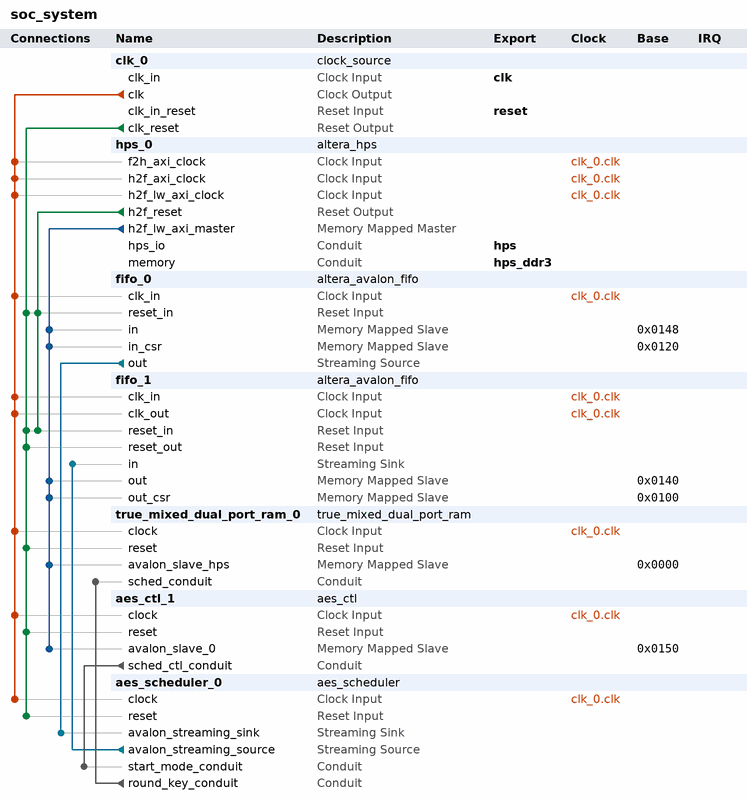
[diagram p0: system contents]
# Platform Designer (Qsys) system soc_system, Cyclone V 5CSEMA5F31C6
# Parameters at their usual value, and those the tool derives, are not listed.
package require -exact qsys 21.1
create_system soc_system
set_project_property DEVICE_FAMILY {Cyclone V}
set_project_property DEVICE 5CSEMA5F31C6

add_instance clk_0 clock_source 21.1
set_instance_parameter_value clk_0 clockFrequency 50000000

add_instance hps_0 altera_hps 21.1
set_instance_parameter_value hps_0 EMAC1_Mode RGMII
set_instance_parameter_value hps_0 EMAC1_PinMuxing {HPS I/O Set 0}
set_instance_parameter_value hps_0 F2SCLK_COLDRST_Enable false
set_instance_parameter_value hps_0 F2SCLK_DBGRST_Enable false
set_instance_parameter_value hps_0 F2SCLK_WARMRST_Enable false
set_instance_parameter_value hps_0 F2SINTERRUPT_Enable false
set_instance_parameter_value hps_0 F2S_Width 2
set_instance_parameter_value hps_0 FPGA_PERIPHERAL_OUTPUT_CLOCK_FREQ_EMAC0_GTX_CLK 125
set_instance_parameter_value hps_0 FPGA_PERIPHERAL_OUTPUT_CLOCK_FREQ_EMAC0_MD_CLK 2.5
set_instance_parameter_value hps_0 FPGA_PERIPHERAL_OUTPUT_CLOCK_FREQ_EMAC1_GTX_CLK 125
set_instance_parameter_value hps_0 FPGA_PERIPHERAL_OUTPUT_CLOCK_FREQ_EMAC1_MD_CLK 2.5
set_instance_parameter_value hps_0 HPS_PROTOCOL DDR3
set_instance_parameter_value hps_0 I2C0_Mode I2C
set_instance_parameter_value hps_0 I2C0_PinMuxing {HPS I/O Set 0}
set_instance_parameter_value hps_0 I2C1_Mode I2C
set_instance_parameter_value hps_0 I2C1_PinMuxing {HPS I/O Set 0}
set_instance_parameter_value hps_0 LWH2F_Enable true
set_instance_parameter_value hps_0 MEM_BANKADDR_WIDTH 3
set_instance_parameter_value hps_0 MEM_CLK_FREQ 400.0
set_instance_parameter_value hps_0 MEM_COL_ADDR_WIDTH 10
set_instance_parameter_value hps_0 MEM_DQ_WIDTH 32
set_instance_parameter_value hps_0 MEM_DRV_STR RZQ/7
set_instance_parameter_value hps_0 MEM_ROW_ADDR_WIDTH 15
set_instance_parameter_value hps_0 MEM_RTT_NOM RZQ/4
set_instance_parameter_value hps_0 MEM_RTT_WR RZQ/4
set_instance_parameter_value hps_0 MEM_TCL 11
set_instance_parameter_value hps_0 MEM_TFAW_NS 30.0
set_instance_parameter_value hps_0 MEM_TRAS_NS 35.0
set_instance_parameter_value hps_0 MEM_TRCD_NS 13.75
set_instance_parameter_value hps_0 MEM_TRFC_NS 260.0
set_instance_parameter_value hps_0 MEM_TRP_NS 13.75
set_instance_parameter_value hps_0 MEM_TRRD_NS 7.7
set_instance_parameter_value hps_0 MEM_VENDOR JEDEC
set_instance_parameter_value hps_0 MEM_WTCL 8
set_instance_parameter_value hps_0 QSPI_Mode N/A
set_instance_parameter_value hps_0 QSPI_PinMuxing Unused
set_instance_parameter_value hps_0 REF_CLK_FREQ 25.0
set_instance_parameter_value hps_0 S2FCLK_USER1CLK_Enable true
set_instance_parameter_value hps_0 S2FCLK_USER2CLK 5
set_instance_parameter_value hps_0 S2F_Width 2
set_instance_parameter_value hps_0 SDIO_Mode {4-bit Data}
set_instance_parameter_value hps_0 SDIO_PinMuxing {HPS I/O Set 0}
set_instance_parameter_value hps_0 SPIM1_Mode {Single Slave Select}
set_instance_parameter_value hps_0 SPIM1_PinMuxing {HPS I/O Set 0}
set_instance_parameter_value hps_0 STM_Enable false
set_instance_parameter_value hps_0 TIMING_BOARD_AC_SKEW 0.03
set_instance_parameter_value hps_0 TIMING_BOARD_AC_TO_CK_SKEW 0.0
set_instance_parameter_value hps_0 TIMING_BOARD_DQ_TO_DQS_SKEW 0.0
set_instance_parameter_value hps_0 TIMING_BOARD_MAX_CK_DELAY 0.03
set_instance_parameter_value hps_0 TIMING_BOARD_MAX_DQS_DELAY 0.02
set_instance_parameter_value hps_0 TIMING_BOARD_SKEW_BETWEEN_DQS 0.08
set_instance_parameter_value hps_0 TIMING_BOARD_SKEW_CKDQS_DIMM_MAX 0.16
set_instance_parameter_value hps_0 TIMING_BOARD_SKEW_CKDQS_DIMM_MIN 0.09
set_instance_parameter_value hps_0 TIMING_BOARD_SKEW_WITHIN_DQS 0.01
set_instance_parameter_value hps_0 TIMING_TDH 65
set_instance_parameter_value hps_0 TIMING_TDQSCK 255
set_instance_parameter_value hps_0 TIMING_TDQSQ 125
set_instance_parameter_value hps_0 TIMING_TDS 30
set_instance_parameter_value hps_0 TIMING_TIH 140
set_instance_parameter_value hps_0 TIMING_TIS 180
set_instance_parameter_value hps_0 TIMING_TQSH 0.4
set_instance_parameter_value hps_0 UART0_Mode {No Flow Control}
set_instance_parameter_value hps_0 UART0_PinMuxing {HPS I/O Set 0}
set_instance_parameter_value hps_0 USB1_Mode SDR
set_instance_parameter_value hps_0 USB1_PinMuxing {HPS I/O Set 0}
set_instance_parameter_value hps_0 desired_cfg_clk_mhz 97.368421
set_instance_parameter_value hps_0 desired_qspi_clk_mhz 400.0

add_instance fifo_0 altera_avalon_fifo 21.1
set_instance_parameter_value fifo_0 bitsPerSymbol 32
set_instance_parameter_value fifo_0 channelWidth 8
set_instance_parameter_value fifo_0 errorWidth 8
set_instance_parameter_value fifo_0 fifoDepth 2048
set_instance_parameter_value fifo_0 fifoInputInterfaceOptions AVALONMM_WRITE
set_instance_parameter_value fifo_0 fifoOutputInterfaceOptions AVALONST_SOURCE
set_instance_parameter_value fifo_0 singleClockMode true
set_instance_parameter_value fifo_0 symbolsPerBeat 1
set_instance_parameter_value fifo_0 useIRQ false
set_instance_parameter_value fifo_0 usePacket false
set_instance_parameter_value fifo_0 useReadControl false

add_instance fifo_1 altera_avalon_fifo 21.1
set_instance_parameter_value fifo_1 bitsPerSymbol 32
set_instance_parameter_value fifo_1 channelWidth 8
set_instance_parameter_value fifo_1 errorWidth 8
set_instance_parameter_value fifo_1 fifoDepth 2048
set_instance_parameter_value fifo_1 fifoInputInterfaceOptions AVALONST_SINK
set_instance_parameter_value fifo_1 fifoOutputInterfaceOptions AVALONMM_READ
set_instance_parameter_value fifo_1 singleClockMode false
set_instance_parameter_value fifo_1 symbolsPerBeat 1
set_instance_parameter_value fifo_1 useIRQ false
set_instance_parameter_value fifo_1 usePacket false
set_instance_parameter_value fifo_1 useReadControl true
set_instance_parameter_value fifo_1 useWriteControl false

add_instance true_mixed_dual_port_ram_0 true_mixed_dual_port_ram 1.0
set_instance_parameter_value true_mixed_dual_port_ram_0 ADDRESS_WIDTH1 6
set_instance_parameter_value true_mixed_dual_port_ram_0 ADDRESS_WIDTH2 4
set_instance_parameter_value true_mixed_dual_port_ram_0 DATA_WIDTH1 32

add_instance aes_ctl_1 aes_ctl 1.0

add_instance aes_scheduler_0 aes_scheduler 1.0
set_instance_parameter_value aes_scheduler_0 N_CORES 10

# connections
add_connection clk_0.clk aes_ctl_1.clock clock
add_connection clk_0.clk aes_scheduler_0.clock clock
add_connection clk_0.clk fifo_0.clk_in clock
add_connection clk_0.clk fifo_1.clk_in clock
add_connection clk_0.clk fifo_1.clk_out clock
add_connection clk_0.clk hps_0.f2h_axi_clock clock
add_connection clk_0.clk hps_0.h2f_axi_clock clock
add_connection clk_0.clk hps_0.h2f_lw_axi_clock clock
add_connection clk_0.clk true_mixed_dual_port_ram_0.clock clock
add_connection clk_0.clk_reset aes_ctl_1.reset reset
add_connection clk_0.clk_reset aes_scheduler_0.reset reset
add_connection clk_0.clk_reset fifo_0.reset_in reset
add_connection clk_0.clk_reset fifo_1.reset_in reset
add_connection clk_0.clk_reset fifo_1.reset_out reset
add_connection clk_0.clk_reset true_mixed_dual_port_ram_0.reset reset
add_connection hps_0.h2f_reset fifo_0.reset_in reset
add_connection hps_0.h2f_reset fifo_1.reset_in reset
add_connection hps_0.h2f_lw_axi_master aes_ctl_1.avalon_slave_0 avalon
set_connection_parameter_value hps_0.h2f_lw_axi_master/aes_ctl_1.avalon_slave_0 baseAddress 0x0150
add_connection hps_0.h2f_lw_axi_master fifo_0.in avalon
set_connection_parameter_value hps_0.h2f_lw_axi_master/fifo_0.in baseAddress 0x0148
add_connection hps_0.h2f_lw_axi_master fifo_0.in_csr avalon
set_connection_parameter_value hps_0.h2f_lw_axi_master/fifo_0.in_csr baseAddress 0x0120
add_connection hps_0.h2f_lw_axi_master fifo_1.out avalon
set_connection_parameter_value hps_0.h2f_lw_axi_master/fifo_1.out baseAddress 0x0140
add_connection hps_0.h2f_lw_axi_master fifo_1.out_csr avalon
set_connection_parameter_value hps_0.h2f_lw_axi_master/fifo_1.out_csr baseAddress 0x0100
add_connection hps_0.h2f_lw_axi_master true_mixed_dual_port_ram_0.avalon_slave_hps avalon
set_connection_parameter_value hps_0.h2f_lw_axi_master/true_mixed_dual_port_ram_0.avalon_slave_hps baseAddress 0x0000
add_connection aes_scheduler_0.avalon_streaming_source fifo_1.in avalon_streaming
add_connection fifo_0.out aes_scheduler_0.avalon_streaming_sink avalon_streaming
add_connection aes_ctl_1.sched_ctl_conduit aes_scheduler_0.start_mode_conduit conduit
add_connection aes_scheduler_0.round_key_conduit true_mixed_dual_port_ram_0.sched_conduit conduit

# exported interfaces
add_interface clk clock sink
set_interface_property clk EXPORT_OF clk_0.clk_in
add_interface hps conduit end
set_interface_property hps EXPORT_OF hps_0.hps_io
add_interface hps_ddr3 conduit end
set_interface_property hps_ddr3 EXPORT_OF hps_0.memory
add_interface reset reset sink
set_interface_property reset EXPORT_OF clk_0.clk_in_reset

set_interconnect_requirement {$system} qsys_mm.clockCrossingAdapter HANDSHAKE
set_interconnect_requirement {$system} qsys_mm.enableEccProtection FALSE
set_interconnect_requirement {$system} qsys_mm.insertDefaultSlave FALSE
set_interconnect_requirement {$system} qsys_mm.maxAdditionalLatency 1

save_system soc_system.qsys
